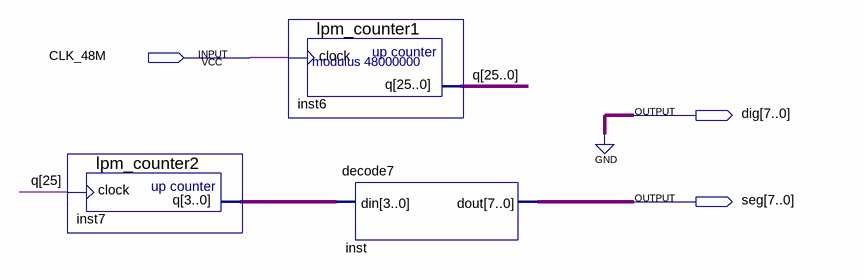
[diagram p0: schematic sheet]
// Quartus schematic sled.bdf as structural Verilog: 3 symbols, 3 pins
module sled (
  input  CLK_48M,
  output [7:0] dig,
  output [7:0] seg
);

  wire [3:0] inst7_q;
  wire [25:0] q;

  lpm_counter2 inst7 (.clock(q[25]), .q(inst7_q));
  lpm_counter1 inst6 (.clock(CLK_48M), .q(q));
  decode7 inst (.din(inst7_q), .dout(seg));

  assign dig = {8{1'b0}};
endmodule
